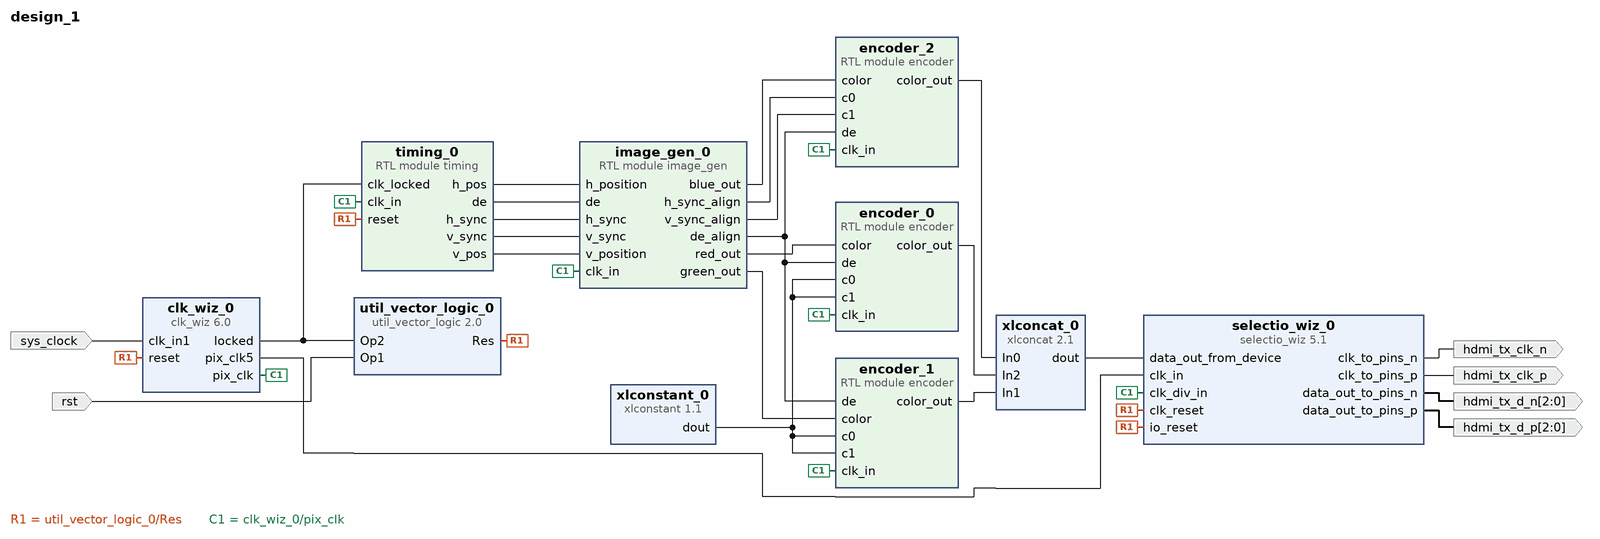
[diagram p0: block diagram of the top level]
# Vivado block design design_1, xc7z020clg400-1, Vivado 2018.1
create_bd_design design_1

create_bd_port -dir I -type clk sys_clock
set_property -dict {CONFIG.FREQ_HZ 125000000 CONFIG.PHASE 0.000} [get_bd_ports sys_clock]
create_bd_port -dir I -type rst rst
set_property -dict {CONFIG.POLARITY ACTIVE_HIGH} [get_bd_ports rst]
create_bd_port -dir O -type clk hdmi_tx_clk_n
create_bd_port -dir O -type clk hdmi_tx_clk_p
create_bd_port -dir O -from 2 -to 0 -type data hdmi_tx_d_n
create_bd_port -dir O -from 2 -to 0 -type data hdmi_tx_d_p

create_bd_cell -type ip -vlnv xilinx.com:ip:clk_wiz:6.0 clk_wiz_0
set_property -dict [list \
  CONFIG.CLKIN1_JITTER_PS 80.0 \
  CONFIG.CLKOUT2_USED true \
  CONFIG.NUM_OUT_CLKS 2 \
  CONFIG.CLK_OUT1_PORT pix_clk \
  CONFIG.CLK_OUT2_PORT pix_clk5 \
  CONFIG.CLKOUT1_REQUESTED_OUT_FREQ 74.25 \
  CONFIG.CLKOUT2_REQUESTED_OUT_FREQ 371.25 \
  CONFIG.CLKOUT2_DRIVES BUFG \
  CONFIG.MMCM_DIVCLK_DIVIDE 7 \
  CONFIG.MMCM_CLKFBOUT_MULT_F 62.375 \
  CONFIG.MMCM_CLKIN1_PERIOD 8.000 \
  CONFIG.MMCM_CLKIN2_PERIOD 10.000 \
  CONFIG.MMCM_CLKOUT0_DIVIDE_F 15.000 \
  CONFIG.MMCM_CLKOUT1_DIVIDE 3 \
  CONFIG.USE_BOARD_FLOW true \
  CONFIG.CLK_IN1_BOARD_INTERFACE sys_clock \
  CONFIG.CLKOUT1_JITTER 239.766 \
  CONFIG.CLKOUT1_PHASE_ERROR 368.066 \
  CONFIG.CLKOUT2_JITTER 192.979 \
  CONFIG.CLKOUT2_PHASE_ERROR 368.066 \
] [get_bd_cells clk_wiz_0]
create_bd_cell -type ip -vlnv xilinx.com:ip:util_vector_logic:2.0 util_vector_logic_0
set_property -dict {CONFIG.C_SIZE 1 CONFIG.C_OPERATION and} [get_bd_cells util_vector_logic_0]
create_bd_cell -type module -reference timing timing_0
create_bd_cell -type ip -vlnv xilinx.com:ip:xlconstant:1.1 xlconstant_0
set_property -dict {CONFIG.CONST_VAL 0} [get_bd_cells xlconstant_0]
create_bd_cell -type module -reference encoder encoder_0
create_bd_cell -type module -reference encoder encoder_1
create_bd_cell -type module -reference encoder encoder_2
create_bd_cell -type module -reference image_gen image_gen_0
create_bd_cell -type ip -vlnv xilinx.com:ip:selectio_wiz:5.1 selectio_wiz_0
set_property -dict [list \
  CONFIG.USE_TEMPLATE DVI_Transmitter \
  CONFIG.BUS_DIR OUTPUTS \
  CONFIG.BUS_SIG_TYPE DIFF \
  CONFIG.BUS_IO_STD DIFF_HSTL_I \
  CONFIG.SELIO_ACTIVE_EDGE DDR \
  CONFIG.USE_SERIALIZATION true \
  CONFIG.SERIALIZATION_FACTOR 10 \
  CONFIG.SYSTEM_DATA_WIDTH 3 \
  CONFIG.SELIO_INTERFACE_TYPE NETWORKING \
  CONFIG.SELIO_BUS_IN_DELAY NONE \
  CONFIG.SELIO_CLK_SIG_TYPE DIFF \
  CONFIG.SELIO_CLK_IO_STD DIFF_HSTL_I \
  CONFIG.SELIO_CLK_BUF MMCM \
  CONFIG.CLK_FWD true \
  CONFIG.CLK_FWD_SIG_TYPE DIFF \
  CONFIG.CLK_FWD_IO_STD DIFF_HSTL_I \
] [get_bd_cells selectio_wiz_0]
create_bd_cell -type ip -vlnv xilinx.com:ip:xlconcat:2.1 xlconcat_0
set_property -dict {CONFIG.NUM_PORTS 3 CONFIG.IN0_WIDTH 10 CONFIG.IN1_WIDTH 10 CONFIG.IN2_WIDTH 10} [get_bd_cells xlconcat_0]

# ---- connections ----

connect_bd_net [get_bd_pins util_vector_logic_0/Res] \
  [get_bd_pins clk_wiz_0/reset] [get_bd_pins timing_0/reset] [get_bd_pins selectio_wiz_0/clk_reset] \
  [get_bd_pins selectio_wiz_0/io_reset]
connect_bd_net [get_bd_pins timing_0/h_pos] [get_bd_pins image_gen_0/h_position]
connect_bd_net [get_bd_pins timing_0/de] [get_bd_pins image_gen_0/de]
connect_bd_net [get_bd_pins timing_0/h_sync] [get_bd_pins image_gen_0/h_sync]
connect_bd_net [get_bd_pins timing_0/v_sync] [get_bd_pins image_gen_0/v_sync]
connect_bd_net [get_bd_pins image_gen_0/red_out] [get_bd_pins encoder_0/color]
connect_bd_net [get_bd_pins image_gen_0/green_out] [get_bd_pins encoder_1/color]
connect_bd_net [get_bd_pins image_gen_0/blue_out] [get_bd_pins encoder_2/color]
connect_bd_net [get_bd_pins image_gen_0/de_align] [get_bd_pins encoder_0/de] [get_bd_pins encoder_1/de] [get_bd_pins encoder_2/de]
connect_bd_net [get_bd_pins image_gen_0/h_sync_align] [get_bd_pins encoder_2/c0]
connect_bd_net [get_bd_pins image_gen_0/v_sync_align] [get_bd_pins encoder_2/c1]
connect_bd_net [get_bd_pins xlconstant_0/dout] \
  [get_bd_pins encoder_0/c0] [get_bd_pins encoder_0/c1] [get_bd_pins encoder_1/c0] [get_bd_pins encoder_1/c1]
connect_bd_net [get_bd_ports sys_clock] [get_bd_pins clk_wiz_0/clk_in1]
connect_bd_net [get_bd_ports rst] [get_bd_pins util_vector_logic_0/Op1]
connect_bd_net -net clk_wiz_1_locked [get_bd_pins clk_wiz_0/locked] [get_bd_pins util_vector_logic_0/Op2] [get_bd_pins timing_0/clk_locked]
connect_bd_net -net clk_wiz_1_clk_pix [get_bd_pins clk_wiz_0/pix_clk] \
  [get_bd_pins timing_0/clk_in] [get_bd_pins image_gen_0/clk_in] [get_bd_pins encoder_0/clk_in] \
  [get_bd_pins encoder_1/clk_in] [get_bd_pins encoder_2/clk_in] [get_bd_pins selectio_wiz_0/clk_div_in]
connect_bd_net [get_bd_pins encoder_2/color_out] [get_bd_pins xlconcat_0/In0]
connect_bd_net [get_bd_pins encoder_1/color_out] [get_bd_pins xlconcat_0/In1]
connect_bd_net [get_bd_pins encoder_0/color_out] [get_bd_pins xlconcat_0/In2]
connect_bd_net [get_bd_pins xlconcat_0/dout] [get_bd_pins selectio_wiz_0/data_out_from_device]
connect_bd_net [get_bd_pins selectio_wiz_0/clk_to_pins_n] [get_bd_ports hdmi_tx_clk_n]
connect_bd_net [get_bd_pins selectio_wiz_0/clk_to_pins_p] [get_bd_ports hdmi_tx_clk_p]
connect_bd_net [get_bd_pins selectio_wiz_0/data_out_to_pins_n] [get_bd_ports hdmi_tx_d_n]
connect_bd_net [get_bd_pins selectio_wiz_0/data_out_to_pins_p] [get_bd_ports hdmi_tx_d_p]
connect_bd_net [get_bd_pins timing_0/v_pos] [get_bd_pins image_gen_0/v_position]
connect_bd_net [get_bd_pins clk_wiz_0/pix_clk5] [get_bd_pins selectio_wiz_0/clk_in]

validate_bd_design
save_bd_design
